# Altium schematic sheet Power.SchDoc: Power
size A4; Organization: ORGANIZATION; Address1: ADDRESS 1; Address2: ADDRESS 2; Address3: ADDRESS 3; Address4: ADDRESS 4; Revision: -; SheetNumber: 2; SheetTotal: 11; ENG_APP_DATE: --/--/--; DSN_APP_DATE: --/--/--; CHK_APP_DATE: --/--/--
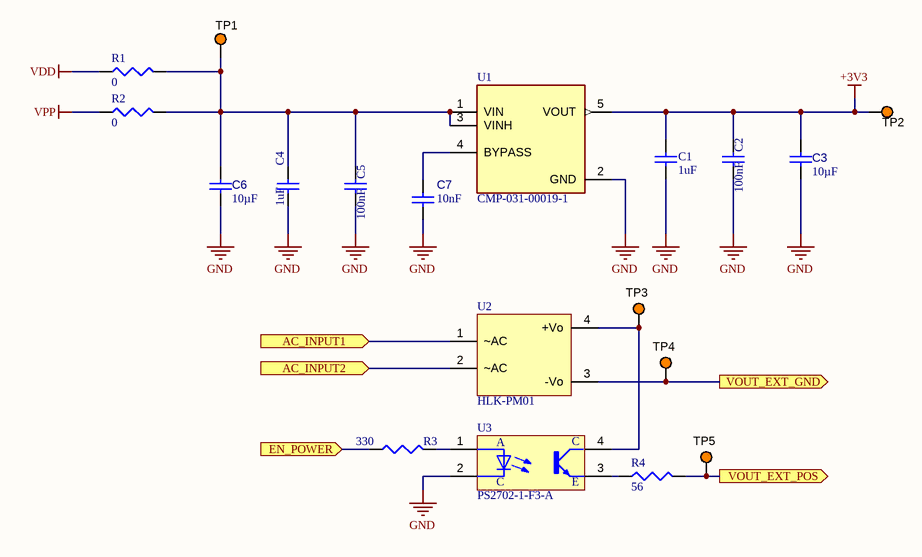
[diagram p0: Power.SchDoc]

## Parts
C1  value 1uF  [C0603]  (hidden comment: CL10A105KA8NNNC)
C2  value 100nF  [C0603]  (hidden comment: CC0603KRX7R8BB104)
C3  value 10µF  [0805]  (hidden comment: C0805C106K9PACTU)
C4  value 1uF  [C0603]  (hidden comment: CL10A105KA8NNNC)
C5  value 100nF  [C0603]  (hidden comment: CC0603KRX7R8BB104)
C6  value 10µF  [0805]  (hidden comment: C0805C106K9PACTU)
C7  value 10nF  [C0603]  (hidden comment: 06035C103KAT2A)
R1  value 0  [R0603]  (hidden comment: RMCF0603ZT0R00)
R2  value 0  [R0603]  (hidden comment: RMCF0603ZT0R00)
R3  value 330  [R0603]  (hidden comment: RC0603FR-07330RL)
R4  value 56  [R2512]  (hidden comment: 4-1879501-3)
TP1  5003  [KSTN-5003]  (value not drawn)
TP2  5003  [KSTN-5003]  (value not drawn)
TP3  5003  [KSTN-5003]  (value not drawn)
TP4  5003  [KSTN-5003]  (value not drawn)
TP5  5003  [KSTN-5003]  (value not drawn)
U1  CMP-031-00019-1  [LM]
U2  HLK-PM01  [HLK-PMO1]
U3  PS2702-1-F3-A  [SOP4]

## Ports
AC_INPUT1 (in), AC_INPUT2 (in), EN_POWER (in), VOUT_EXT_GND (out), VOUT_EXT_POS (out)

## Nets
+3V3: C1.2 C2.1 C3.2 TP2.1 U1.5(VOUT)
GND: C1.1 C2.2 C3.1 C4.1 C5.2 C6.1 C7.1 U1.2(GND) U3.2(C)
VDD: R1.1
VPP: R2.1
AC_INPUT1: U2.1(~AC) ; port AC_INPUT1
AC_INPUT2: U2.2(~AC) ; port AC_INPUT2
EN_POWER: R3.2 ; port EN_POWER
VOUT_EXT_GND: TP4.1 U2.3(-Vo) ; port VOUT_EXT_GND
VOUT_EXT_POS: R4.2 TP5.1 ; port VOUT_EXT_POS
NetC4_2: C4.2 C5.1 C6.2 R1.2 R2.2 TP1.1 U1.1(VIN) U1.3(VINH)
NetC7_2: C7.2 U1.4(BYPASS)
NetR3_1: R3.1 U3.1(A)
NetR4_1: R4.1 U3.3(E)
NetTP3_1: TP3.1 U2.4(+Vo) U3.4(CO)

## Notes on the sheet
- APPROVALS
- DATE
- PROJECT
- Kish Spark Building
- No. 8, Avesta Street
- ENG:
- DSN:
- CHK:
- PROJECT REVISION:
- DESIGN ITEM:
- DOCUMENT REVISION:
- Tehran, Iran
- Seoul Street, Sheikh Bahaie
- SIZE
- REV
- SCALE:
- CAGE CODE
- A4
- FILE NAME
- TITLE
- SHEET
- OF

## Library data of the parts
C1 C4 = Cap_1uF_25V_0603: Cap_1uF_10%_X5R_25V_0603; Manufacturer: Samsung; MFR PART NO: CL10A105KA8NNNC
C2 C5 = CMP-001-00108-2: YAGEO - CC0603KRX7R8BB104 - CERAMIC CAPACITOR, 0.1UF, 25V, X7R, 10%, 0603, FULL REEL; Case/Package: 0603; Pins: 2; RoHS Compliant: Yes; Min Operating Temperature: -55°C; Max Operating Temperature: 125°C; Voltage Rating: 25V; Tolerance: 10%; Design Item ID: CC0603KRX7R8BB104; Case Code (Metric): 1608; Category: Ceramic Capacitors; Depth: 0.8mm; Dielectric: X7R; Halogen Free: Halogen Free; Height: 0.8mm; Lead Free: Lead Free; Length: 1.6mm; Manufacturer 1: Yageo; Manufacturer Part Number 1: CC0603KRX7R8BB104; Mount: Surface Mount; Package Quantity: 1; Packaging: Tape and Reel; Pricing 1: 1=0.10000, 10=0.05000, 50=0.02720, 100=0.02220, 500=0.01586, 1000=0.01246 (USD); Radiation Hardening: No; REACH SVHC: Unknown; Resistor Type: Ceramic; RoHS: Yes; Series: CC; Source: PTZLib.SchLib; Stock 1: 4053185; Termination: SMD/SMT; Thickness: 0.035inch; Voltage: 25V; Voltage Rating (DC): 25V; Width: 0.8mm; ComponentLink1Description: https://datasheet.ciiva.com/144/mlccorderingcode-144075.pdf?src-supplier=Digi-Key; ComponentLink1URL: https://datasheet.ciiva.com/144/mlccorderingcode-144075.pdf?src-supplier=Digi-Key; ComponentLink2Description: https://datasheet.ciiva.com/11786/0900766b80c10176-11786120.pdf?src-supplier=RSComponents; ComponentLink2URL: https://datasheet.ciiva.com/11786/0900766b80c10176-11786120.pdf?src-supplier=RSComponents; ComponentLink3Description: https://datasheet.ciiva.com/7978/1489800-7978155.pdf?src-supplier=Element14; ComponentLink3URL: https://datasheet.ciiva.com/7978/1489800-7978155.pdf?src-supplier=Element14; ComponentLink4Description: https://datasheet.ciiva.com/28450/1489800-28450584.pdf?src-supplier=Element14; ComponentLink4URL: https://datasheet.ciiva.com/28450/1489800-28450584.pdf?src-supplier=Element14; ComponentLink5Description: https://datasheet.ciiva.com/144/mlccorderingcode-144074.pdf?src-supplier=Digi-Key; ComponentLink5URL: https://datasheet.ciiva.com/144/mlccorderingcode-144074.pdf?src-supplier=Digi-Key; ComponentLink6Description: https://datasheet.ciiva.com/144/mlccorderingcode-144073.pdf?src-supplier=Digi-Key; ComponentLink6URL: https://datasheet.ciiva.com/144/mlccorderingcode-144073.pdf?src-supplier=Digi-Key; ComponentLink7Description: https://datasheet.ciiva.com/13389/upy-gphc-x7r-6-3v-to-50v-8-13389352.pdf?src-supplier=Mouser; ComponentLink7URL: https://datasheet.ciiva.com/13389/upy-gphc-x7r-6-3v-to-50v-8-13389352.pdf?src-supplier=Mouser; ComponentLink8Description: https://datasheet.ciiva.com/11587/upy-gphc-x7r-6-3v-to-50v-8-11587208.pdf?src-supplier=Avnet; ComponentLink8URL: https://datasheet.ciiva.com/11587/upy-gphc-x7r-6-3v-to-50v-8-11587208.pdf?src-supplier=Avnet; ComponentLink9Description: https://datasheet.ciiva.com/26829/getdatasheetpartid-403577-26829431.pdf?src-supplier=Verical; ComponentLink9URL: https://datasheet.ciiva.com/26829/getdatasheetpartid-403577-26829431.pdf?src-supplier=Verical; ComponentLink10Description: https://datasheet.ciiva.com/17434/upy-gphc-x7r-6-3v-to-50v-8-17434263.pdf?src-supplier=Avnet+Europe; ComponentLink10URL: https://datasheet.ciiva.com/17434/upy-gphc-x7r-6-3v-to-50v-8-17434263.pdf?src-supplier=Avnet+Europe
C3 C6 = CMP-001-00180-2: Ceramic Capacitor, 10UF, 6.3V, X5R, 10%, 0805, Full Reel; Manufacturer: KEMET; Dissipation Factor: 5%; Capacitor Type: Ceramic Capacitors; Manufacturer Part Number: C0805C106K9PACTU; Mount: Surface Mount; Case/Package: 0805; Case Code (Metric): 2012; Dielectric Material: Ceramic; Contact Material: Tin; Min Operating Temperature: -55°C; Max Operating Temperature: 85°C; Tolerance: 10%; Voltage Rating (DC): 6.3V; Dielectric: X5R; Packaging: Tape and Reel; Voltage Rating: 6.3V; Series: SMD Comm X5R; Construction: Flat; Length: 2mm; Width: 1.2mm; Height: 1.25mm; Depth: 1.25mm; Lead Pitch: 0.75mm; Radiation Hardening: No; RoHS Compliant: Yes; Lead Free: Lead Free; Reach SVHC Compliant: No; ComponentLink1URL: https://datasheet.ciiva.com/7842/kem-c1006-x5r-smd-7842200.pdf?src-supplier=Element14; ComponentLink1Description: https://datasheet.ciiva.com/7842/kem-c1006-x5r-smd-7842200.pdf?src-supplier=Element14; ComponentLink2URL: https://datasheet.ciiva.com/7842/kem-c1006-x5r-smd-7842201.pdf?src-supplier=Element14; ComponentLink2Description: https://datasheet.ciiva.com/7842/kem-c1006-x5r-smd-7842201.pdf?src-supplier=Element14; ComponentLink3URL: https://datasheet.ciiva.com/7842/40889-7842553.pdf?src-supplier=Element14; ComponentLink3Description: https://datasheet.ciiva.com/7842/40889-7842553.pdf?src-supplier=Element14; ComponentLink4URL: https://datasheet.ciiva.com/7842/40889-7842554.pdf?src-supplier=Element14; ComponentLink4Description: https://datasheet.ciiva.com/7842/40889-7842554.pdf?src-supplier=Element14; ComponentLink5URL: https://datasheet.ciiva.com/18193/getdatasheetpartid-320652-18193500.pdf?src-supplier=Verical; ComponentLink5Description: https://datasheet.ciiva.com/18193/getdatasheetpartid-320652-18193500.pdf?src-supplier=Verical; Pins: 2; Mounting Technology: SMD/SMT
C7 = CMP-001-00096-2: 0603 10nF 50 V ±10 % Tolerance X7R Surface Mount Multilayer Ceramic Capacitor; Manufacturer: Kyocera AVX; Voltage Rating: 50V; Tolerance: 10%; Dissipation Factor: 2.5%; Insulation Resistance: 100GR; Case/Package: 0603; Pins: 2; Min Operating Temperature: -55°C; Max Operating Temperature: 125°C; Design Item ID: 06035C103KAT2A; Case Code (Metric): 1608; Category: Ceramic Capacitors; Contact Plating: Tin,Matte; Depth: 0.81mm; Dielectric: X7R; Dielectric Material: Ceramic; Height: 0.9mm; Lead Free: Lead Free; Length: 1.6mm; Manufacturer Part Number: 06035C103KAT2A; Mount: Surface Mount,PCB; Packaging: Tape and Reel; Radiation Hardening: No; REACH SVHC: No SVHC; RoHS: Yes; Stock 1: 4334081; Termination: SMD/SMT; Thickness: 0.035inch; Voltage: 50V; Voltage Rating (DC): 50V; Width: 0.032inch; ComponentLink1Description: https://datasheet.ciiva.com/2987/cx7r-2987824.pdf?src-supplier=Avnet; ComponentLink1URL: https://datasheet.ciiva.com/2987/cx7r-2987824.pdf?src-supplier=Avnet; ComponentLink2Description: https://datasheet.ciiva.com/1124/1679506-1124848.pdf?src-supplier=Element14; ComponentLink2URL: https://datasheet.ciiva.com/1124/1679506-1124848.pdf?src-supplier=Element14; ComponentLink3Description: https://datasheet.ciiva.com/7855/1679506-7855082.pdf?src-supplier=Element14; ComponentLink3URL: https://datasheet.ciiva.com/7855/1679506-7855082.pdf?src-supplier=Element14; ComponentLink4Description: https://datasheet.ciiva.com/150/cx7r-150227.pdf?src-supplier=Digi-Key; ComponentLink4URL: https://datasheet.ciiva.com/150/cx7r-150227.pdf?src-supplier=Digi-Key; ComponentLink5Description: https://datasheet.ciiva.com/150/cx7r-150229.pdf?src-supplier=Digi-Key; ComponentLink5URL: https://datasheet.ciiva.com/150/cx7r-150229.pdf?src-supplier=Digi-Key
R1 R2 = CMP-009-00195-1: Res Thkflm 0603 0 Ohm Jumper 1/10W 100Ppm/ C Smd Rohs Compliant: Yes; Manufacturer 1: Stackpole Electronics; Current Rating: 1A; Max Power Dissipation: 100mW; Working Voltage: 75V; Case/Package: 0603; RoHS Compliant: Yes; Min Operating Temperature: -55°C; Max Operating Temperature: 155°C; Design Item ID: RMCF0603ZT0R00; Case Code (Metric): 1608; Category: Chip SMD Resistors; Construction: Rectangular; Contact Plating: Tin,Matte; Depth: 0.8mm; Features: Automotive AEC-Q200; Height: 0.022inch; Lead Free: Lead Free; Length: 1.55mm; Manufacturer Part Number 1: RMCF0603ZT0R00; Military Standard: Not; Mount: Surface Mount; Number of Terminations: 2; Packaging: Tape and Reel; Power Rating: 100mW; Pricing 1: 1=0.10000, 10=0.01300, 25=0.00960, 50=0.00720, 100=0.00530, 250=0.00404, 500=0.00324, 1000=0.00238 (USD); Radiation Hardening: No; Resistor Type: Thick Film; RoHS: Yes; Series: RMCF; Source: PTZLib.SchLib; Stock 1: 617251; Width: 0.031inch; ComponentLink1Description: https://www.seielect.com/catalog/SEI-Packaging.pdf?src-supplier=Digi-Key; ComponentLink1URL: https://www.seielect.com/catalog/SEI-Packaging.pdf?src-supplier=Digi-Key; ComponentLink2Description: https://www.seielect.com/Catalog/SEI-RMCF_RMCP.pdf?src-supplier=Digi-Key; ComponentLink2URL: https://www.seielect.com/Catalog/SEI-RMCF_RMCP.pdf?src-supplier=Digi-Key; ComponentLink3Description: https://www.seielect.com/catalog/SEI-Packaging.pdf?src-supplier=Arrow+Electronics; ComponentLink3URL: https://www.seielect.com/catalog/SEI-Packaging.pdf?src-supplier=Arrow+Electronics; ComponentLink4Description: https://www.seielect.com/catalog/SEI-Packaging.pdf?src-supplier=Avnet; ComponentLink4URL: https://www.seielect.com/catalog/SEI-Packaging.pdf?src-supplier=Avnet; ComponentLink5Description: https://www.seielect.com/catalog/SEI-Packaging.pdf?src-supplier=Verical; ComponentLink5URL: https://www.seielect.com/catalog/SEI-Packaging.pdf?src-supplier=Verical
R3 = CMP-009-00242-1: Res Thick Film 0603 330 Ohm 1% 0.1W(1/10W) ±100ppm/C Pad SMD T/R; Manufacturer: Yageo; Manufacturer Part Number: RC0603FR-071K54L; Voltage Rating: 50V; Max Power Dissipation: 100mW; Temperature Coefficient: 100ppm/°C; Case/Package: 0603; RoHS Compliant: Yes; Min Operating Temperature: -55°C; Max Operating Temperature: 155°C; Tolerance: 1%; Design Item ID: RC0603FR-071K54L; Case Code (Metric): 1608; Category: Chip SMD Resistors; Construction: Rectangular; Depth: 0.8mm; Features: Moisture Resistant; Height: 450um; Lead Free: Lead Free; Length: 1.6mm; Military Standard: Not; Number of Terminations: 2; Package Quantity: 1; Packaging: Cut Tape; Power Rating: 100mW; Pricing 1: 1=0.10000, 10=0.01800, 50=0.01800, 100=0.00600, 1000=0.00500, 10000=0.00300 (USD); Resistor Type: Thick Film; RoHS: Yes; Series: RC; Size Code: 0603; Stock 1: 61319; Termination: SMD/SMT; Voltage Rating (DC): 50V; Width: 800um; ComponentLink1Description: https://datasheet.ciiva.com/2454/pyu-r-int-thick-7-2454405.pdf?src-supplier=Digi-Key; ComponentLink1URL: https://datasheet.ciiva.com/2454/pyu-r-int-thick-7-2454405.pdf?src-supplier=Digi-Key; ComponentLink2Description: https://datasheet.ciiva.com/2454/pyu-r-int-thick-7-2454406.pdf?src-supplier=Digi-Key; ComponentLink2URL: https://datasheet.ciiva.com/2454/pyu-r-int-thick-7-2454406.pdf?src-supplier=Digi-Key; ComponentLink3Description: https://datasheet.ciiva.com/2454/pyu-r-int-thick-7-2454407.pdf?src-supplier=Digi-Key; ComponentLink3URL: https://datasheet.ciiva.com/2454/pyu-r-int-thick-7-2454407.pdf?src-supplier=Digi-Key; Pins: 2
R4 = CMP-009-00287-2: Res Thick Film 2512 56 Ohm 5% 2W ±100ppm/°C Molded SMD SMD T/R; Manufacturer: TE Connectivity; Voltage Rating: 200V; Number of Resistors: 1; Manufacturer Part Number: 4-1879501-3; Stock: 3706; Mounting Technology: Surface Mount; Case/Package: 2512; Case Code (Metric): 6432; Min Operating Temperature: -55°C; Max Operating Temperature: 155°C; Packaging: Cut Tape; Tolerance: 5%; Temperature Coefficient: 100ppm/°C; Number of Terminations: 2; Series: CRGH; Resistor Type: Power resistor; Voltage Rating (DC): 200V; Termination: Solder; Resistance Tolerance: 5%; Technology: THICK FILM; Length: 6.35mm; Height: 0.55mm; Depth: 3.2mm; RoHS Compliant: Yes; Reach SVHC Compliant: No; ComponentLink1URL: https://datasheet.ciiva.com/12564/ng-ds-1773204-g-214560-12564976.pdf?src-supplier=Mouser; ComponentLink1Description: https://datasheet.ciiva.com/12564/ng-ds-1773204-g-214560-12564976.pdf?src-supplier=Mouser; ComponentLink2URL: https://datasheet.ciiva.com/48778/1755795-48778268.pdf?src-supplier=Element14; ComponentLink2Description: https://datasheet.ciiva.com/48778/1755795-48778268.pdf?src-supplier=Element14; ComponentLink3URL: https://datasheet.ciiva.com/48777/1755795-48777694.pdf?src-supplier=Element14; ComponentLink3Description: https://datasheet.ciiva.com/48777/1755795-48777694.pdf?src-supplier=Element14; Component Type: Standard; Pins: 2; Power: 2W; Case Code (Imperial): 2512
TP1-TP5 = CMP-002-00037-1: Test Point, Orange, Height 4.6 mm, Tail Length 3 mm, 1-Pin THD, RoHS; Manufacturer: Keystone; Case/Package: 5003; RoHS Compliant: True; Datasheet URL: http://keyelco.com/userAssets/file/M65p56.pdf; Mounting Technology: TH; Packaging: Bulk; Package Description: 1-Pin Through Hole Device, Dia 2.54 mm; Pins: 1; Diameter: 2.54mm; Package Reference: 5003; Connector Type: TestPoint; Manufacturer URL: http://www.keyelco.com/; Contact Material: Bronze; Datasheet Version: Jun-15; Contact Plating: Tin; Package Quantity: 10; Colour: Orange
U1 = CMP-031-00019-1: Linear Voltage Regulator IC Positive Fixed 1 Output 3.3V 150mA SOT-23-5; Manufacturer: STMicroelectronics; Number of Outputs: 1; Max Supply Voltage: 6V; Dropout Voltage: 400uV; Input Bias Current: 85uA; Quiescent Current: 150uA; Max Supply Current: 250uA; Power Supply Rejection Ratio (PSRR): 50dB; Min Supply Voltage: 2.5V; Manufacturer Part Number: LD3985M33R; RoHS: Yes; Category: Voltage Regulators - Linear; Stock: 76764; Pricing: 1=0.93, 10=0.832, 50=0.79, 100=0.649, 1000=0.424, 10000=0.39 (USD); Mounting Technology: Surface Mount; Case/Package: SOT-23-5; Pins: 5; Weight: 0.000222oz; Min Operating Temperature: -40°C; Max Operating Temperature: 125°C; Packaging: Cut Tape; Output Voltage: 3.3V; Package Quantity: 3000; Output Current: 150mA; Number of Regulators: 1; Min Output Voltage: 3.3V; Polarity: Positive; Output Type: Fixed; Series: -; Output Configuration: Positive; Length: 3mm; Width: 1.75mm; Height: 1.3mm; Lead Free: Lead Free; RoHS Compliant: Yes; ComponentLink1URL: https://datasheet.ciiva.com/41440/001185181-da-01-en-ic-reg-ldo-3-3v-ld3985m33r-sot-23-5-stm-41440289.pdf?src-supplier=Conrad; ComponentLink1Description: https://datasheet.ciiva.com/41440/001185181-da-01-en-ic-reg-ldo-3-3v-ld3985m33r-sot-23-5-stm-41440289.pdf?src-supplier=Conrad; ComponentLink2URL: https://datasheet.ciiva.com/2042/cd00003395-2042199.pdf?src-supplier=Digi-Key; ComponentLink2Description: https://datasheet.ciiva.com/2042/cd00003395-2042199.pdf?src-supplier=Digi-Key; ComponentLink3URL: https://datasheet.ciiva.com/2042/cd00003395-2042198.pdf?src-supplier=Digi-Key; ComponentLink3Description: https://datasheet.ciiva.com/2042/cd00003395-2042198.pdf?src-supplier=Digi-Key; ComponentLink4URL: https://datasheet.ciiva.com/2042/cd00003395-2042200.pdf?src-supplier=Digi-Key; ComponentLink4Description: https://datasheet.ciiva.com/2042/cd00003395-2042200.pdf?src-supplier=Digi-Key; Design Item ID: LD3985M33R; Component Type: Standard; Pin Count: 5; Source: V4-TEL.SCHLIB
U2 = CMP-076-000004-2: AC-DC Module HLK-PM01 5V 3W Hi-Link; Max Supply Voltage: 240V; Min Supply Voltage: 100V; Nominal Supply Current: 200mA; Output Current: 600mA; Efficiency: 70%; Design Item ID: HLK-PM01; Max Operating Temperature: 60°C; Min Operating Temperature: -25°C; Output Voltage: 5V; Pins: 4; Manufacture: Hi-Link
U3 = CMP-076-000006-2: High Isolation Voltage Darlington Transistor SOP MULTI Photocoupler Series; Manufacturer: Renesas; Number of Channels: 1; Forward Voltage: 1.4V; Collector Emitter Saturation Voltage: 1V; Collector Emitter Voltage (VCEO): 40V; Isolation Voltage: 3.75kV; Input Type: DC; Reverse Breakdown Voltage: 6V; Forward Current: 50mA; Max Power Dissipation: 150mW; Max Collector Current: 200mA; Current Transfer Ratio: 2000%; Rise Time: 200us; Manufacturer Part Number: PS2702-1-F3-A; Category: Optocouplers; Case/Package: SOP; Min Operating Temperature: -55°C; Max Operating Temperature: 100°C; Packaging: Tape and Reel; Number of Elements: 1; Power Dissipation: 150mW; Max Input Current: 50mA; Output Voltage: 40V; Radiation Hardening: No; Lead Free: Lead Free; RoHS Compliant: Yes; ComponentLink1URL: https://datasheet.ciiva.com/15119/getdatasheetpartid-460023-15119224.pdf?src-supplier=Verical; ComponentLink1Description: https://datasheet.ciiva.com/15119/getdatasheetpartid-460023-15119224.pdf?src-supplier=Verical; Component Type: Standard; Mounting Technology: Surface Mount; Pins: 4